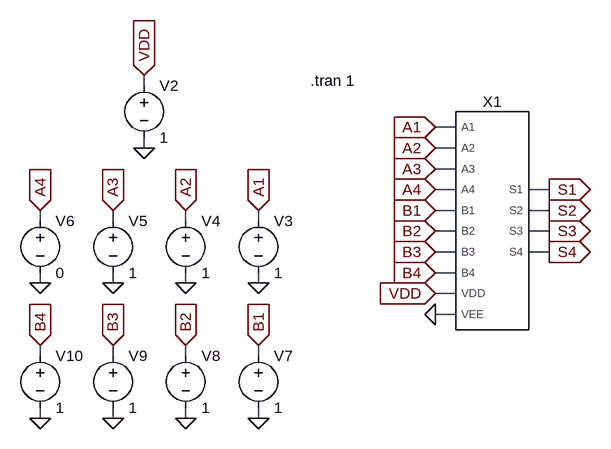
[diagram p0: schematic 4_Bit_Subtractor_Symbol_Test.asc]
4_Bit_Subtractor_Symbol_Test.asc, the LTspice schematic file:
Version 4
SHEET 1 880 680
WIRE -656 112 -656 96
WIRE -176 176 -208 176
WIRE -656 208 -656 192
WIRE -176 208 -208 208
WIRE -176 240 -208 240
WIRE -176 272 -208 272
WIRE -32 272 -64 272
WIRE -176 304 -208 304
WIRE -32 304 -64 304
WIRE -816 320 -816 304
WIRE -704 320 -704 304
WIRE -592 320 -592 304
WIRE -480 320 -480 304
WIRE -176 336 -208 336
WIRE -32 336 -64 336
WIRE -176 368 -208 368
WIRE -32 368 -64 368
WIRE -176 400 -208 400
WIRE -816 416 -816 400
WIRE -704 416 -704 400
WIRE -592 416 -592 400
WIRE -480 416 -480 400
WIRE -176 432 -208 432
WIRE -176 464 -208 464
WIRE -816 528 -816 512
WIRE -704 528 -704 512
WIRE -592 528 -592 512
WIRE -480 528 -480 512
WIRE -816 624 -816 608
WIRE -704 624 -704 608
WIRE -592 624 -592 608
WIRE -480 624 -480 608
FLAG -704 624 0
FLAG -592 624 0
FLAG -816 624 0
FLAG -480 624 0
FLAG -592 416 0
FLAG -704 416 0
FLAG -816 416 0
FLAG -480 416 0
FLAG -656 208 0
FLAG -656 96 VDD
IOPIN -656 96 In
FLAG -480 304 A1
IOPIN -480 304 In
FLAG -592 304 A2
IOPIN -592 304 In
FLAG -704 304 A3
IOPIN -704 304 In
FLAG -816 304 A4
IOPIN -816 304 In
FLAG -480 512 B1
IOPIN -480 512 In
FLAG -592 512 B2
IOPIN -592 512 In
FLAG -704 512 B3
IOPIN -704 512 In
FLAG -816 512 B4
IOPIN -816 512 In
FLAG -208 432 VDD
IOPIN -208 432 In
FLAG -208 400 B4
IOPIN -208 400 In
FLAG -208 368 B3
IOPIN -208 368 In
FLAG -208 336 B2
IOPIN -208 336 In
FLAG -208 304 B1
IOPIN -208 304 In
FLAG -208 272 A4
IOPIN -208 272 In
FLAG -208 240 A3
IOPIN -208 240 In
FLAG -208 208 A2
IOPIN -208 208 In
FLAG -208 176 A1
IOPIN -208 176 In
FLAG -32 272 S1
IOPIN -32 272 Out
FLAG -32 304 S2
IOPIN -32 304 Out
FLAG -32 336 S3
IOPIN -32 336 Out
FLAG -32 368 S4
IOPIN -32 368 Out
FLAG -208 464 0
SYMBOL 4_Bit_Subtractor_Symbol -128 320 R0
SYMATTR InstName X1
SYMBOL Voltage -656 96 R0
SYMATTR InstName V2
SYMATTR Value 1
SYMBOL Voltage -480 304 R0
SYMATTR InstName V3
SYMATTR Value 1
SYMBOL Voltage -592 304 R0
SYMATTR InstName V4
SYMATTR Value 1
SYMBOL Voltage -704 304 R0
SYMATTR InstName V5
SYMATTR Value 1
SYMBOL Voltage -816 304 R0
SYMATTR InstName V6
SYMATTR Value 0
SYMBOL Voltage -480 512 R0
SYMATTR InstName V7
SYMATTR Value 1
SYMBOL Voltage -592 512 R0
SYMATTR InstName V8
SYMATTR Value 1
SYMBOL Voltage -704 512 R0
SYMATTR InstName V9
SYMATTR Value 1
SYMBOL Voltage -816 512 R0
SYMATTR InstName V10
SYMATTR Value 1
TEXT -400 104 Left 2 !.tran 1

The netlist it stands for:
* 4_Bit_Subtractor_Symbol_Test.asc
XX1 A1 A2 A3 A4 B1 B2 B3 B4 VDD 0 S1 S2 S3 S4 4_Bit_Subtractor_Symbol  ; pins A1 A2 A3 A4 B1 B2 B3 B4 VDD VEE S1 S2 S3 S4
V2 VDD 0 1
V3 A1 0 1
V4 A2 0 1
V5 A3 0 1
V6 A4 0 0
V7 B1 0 1
V8 B2 0 1
V9 B3 0 1
V10 B4 0 1
.tran 1
.backanno
.end